# EAGLE design Meshtastic-DIY_v1.03 (EAGLE 9.6.2)
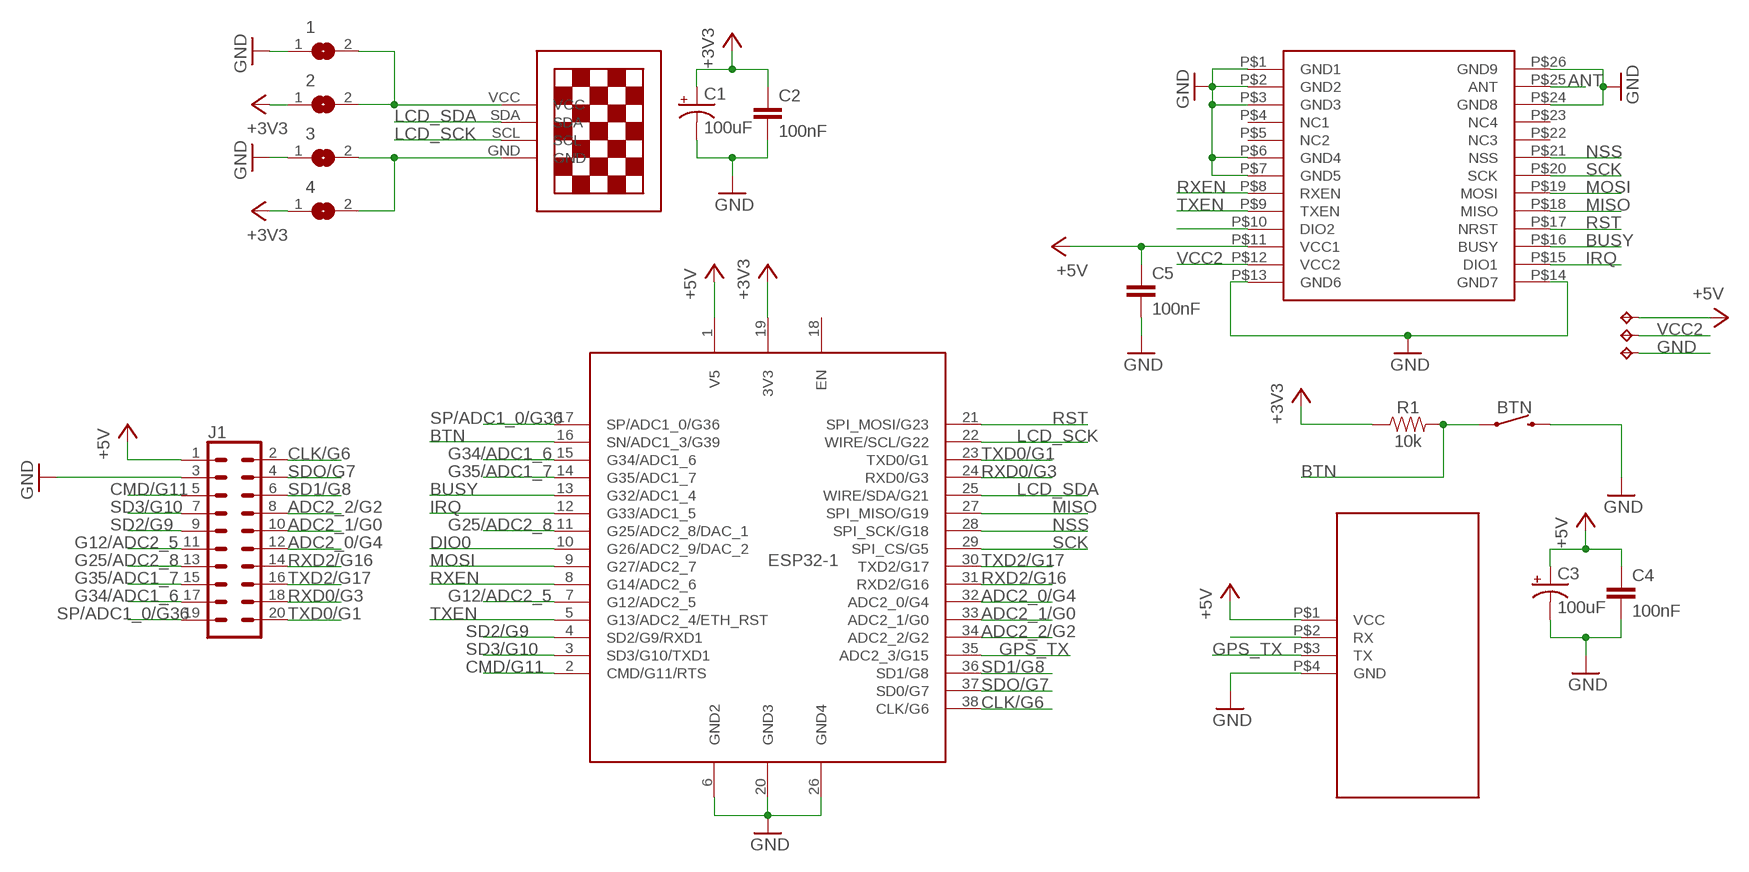
[diagram p0: schematic, sheet 1]

## Parts
1  SJ  [SJ]
2  SJ  [SJ]
3  SJ  [SJ]
4  SJ  [SJ]
BTN  MOMENTARY-SWITCH-SPST-SMD-5.2MM  [TACTILE_SWITCH_SMD_5.2MM]
C1  100uF  100UF-POLAR-EIA7343-10V-10%(TANT)  [EIA7343]
C2  100nF  0.33UF/330NF-0805-50V-10%  [0805]
C3  100uF  100UF-POLAR-EIA7343-10V-10%(TANT)  [EIA7343]
C4  100nF  0.33UF/330NF-0805-50V-10%  [0805]
C5  100nF  0.33UF/330NF-0805-50V-10%  [0805]
ESP32-1  NODEMCU_ESP32_WROOM_32  [NODEMCU_ESP32_WROOM_32--38PINS]
J1  CONN_10X2NOSILK  [2X10_NOSILK]
R1  10k  0.1OHM-1210-1/2W-1%  [1210]
TP1  TPTP14SQ  [TP14SQ]
TP2  TPTP14SQ  [TP14SQ]
TP3  TPTP14SQ  [TP14SQ]
U$1  13"OLED13"OLED  [1.3"OLED]
U$2  E22-XXXMXXS  [E22-XXXMXXS]
U$3  GPS-NEO  [GPS-NEO]

## Nets
+3V3: 2.1 4.1 C1.A(+) C2.1 ESP32-1.19(3V3) R1.1
+5V: C3.A(+) C4.1 C5.1 ESP32-1.1(V5) J1.1 TP1.TP U$2.P$11(VCC1) U$3.P$1(VCC)
ADC2_0/G4: ESP32-1.32(ADC2_0/G4) J1.12
ADC2_1/G0: ESP32-1.33(ADC2_1/G0) J1.10
ADC2_2/G2: ESP32-1.34(ADC2_2/G2) J1.8
ANT: U$2.P$25(ANT)
BTN: BTN.1 ESP32-1.16(SN/ADC1_3/G39) R1.2
BUSY: ESP32-1.13(G32/ADC1_4) U$2.P$16(BUSY)
CLK/G6: ESP32-1.38(CLK/G6) J1.2
CMD/G11: ESP32-1.2(CMD/G11/RTS) J1.5
DIO0: ESP32-1.10(G26/ADC2_9/DAC_2)
G12/ADC2_5: ESP32-1.7(G12/ADC2_5) J1.11
G25/ADC2_8: ESP32-1.11(G25/ADC2_8/DAC_1) J1.13
G34/ADC1_6: ESP32-1.15(G34/ADC1_6) J1.17
G35/ADC1_7: ESP32-1.14(G35/ADC1_7) J1.15
GND: 1.1 3.1 BTN.3 C1.C(-) C2.2 C3.C(-) C4.2 C5.2 ESP32-1.6(GND2) ESP32-1.20(GND3) ESP32-1.26(GND4) J1.3 TP3.TP U$2.P$1(GND1) U$2.P$2(GND2) U$2.P$3(GND3) U$2.P$6(GND4) U$2.P$7(GND5) U$2.P$13(GND6) U$2.P$14(GND7) U$2.P$24(GND8) U$2.P$26(GND9) U$3.P$4(GND)
GPS_TX: ESP32-1.35(ADC2_3/G15) U$3.P$3(TX)
IRQ: ESP32-1.12(G33/ADC1_5) U$2.P$15(DIO1)
LCD_SCK: ESP32-1.22(WIRE/SCL/G22) U$1.SCL
LCD_SDA: ESP32-1.25(WIRE/SDA/G21) U$1.SDA
MISO: ESP32-1.27(SPI_MISO/G19) U$2.P$18(MISO)
MOSI: ESP32-1.9(G27/ADC2_7) U$2.P$19(MOSI)
N$1: U$2.P$10(DIO2)
N$2: 3.2 4.2 U$1.GND
N$3: U$3.P$2(RX)
N$4: 1.2 2.2 U$1.VCC
NSS: ESP32-1.28(SPI_SCK/G18) U$2.P$21(NSS)
RST: ESP32-1.21(SPI_MOSI/G23) U$2.P$17(NRST)
RXD0/G3: ESP32-1.24(RXD0/G3) J1.18
RXD2/G16: ESP32-1.31(RXD2/G16) J1.14
RXEN: ESP32-1.8(G14/ADC2_6) U$2.P$8(RXEN)
SCK: ESP32-1.29(SPI_CS/G5) U$2.P$20(SCK)
SD1/G8: ESP32-1.36(SD1/G8) J1.6
SD2/G9: ESP32-1.4(SD2/G9/RXD1) J1.9
SD3/G10: ESP32-1.3(SD3/G10/TXD1) J1.7
SDO/G7: ESP32-1.37(SD0/G7) J1.4
SP/ADC1_0/G36: ESP32-1.17(SP/ADC1_0/G36) J1.19
TXD0/G1: ESP32-1.23(TXD0/G1) J1.20
TXD2/G17: ESP32-1.30(TXD2/G17) J1.16
TXEN: ESP32-1.5(G13/ADC2_4/ETH_RST) U$2.P$9(TXEN)
VCC2: TP2.TP U$2.P$12(VCC2)
Unconnected: ESP32-1.18(EN) U$2.P$4(NC1) U$2.P$5(NC2) U$2.P$22(NC3) U$2.P$23(NC4)

## Library data of the parts
1-4 = jumper:SJ: SMD solder JUMPER
BTN = SparkFun-Switches:MOMENTARY-SWITCH-SPST: Momentary Switch (Pushbutton) - SPST Normally-open (NO) SPST momentary switches (buttons, pushbuttons). Variants PTH-12MM - 12mm square, through-hole Momentary Pushbutton Switch - 12mm Square <https://www.sparkfun.com/products/9190> (COM-09190) PTH-6.0MM, PTH-6.0MM-KIT - 6.0mm square, through-hole Mini Pushbutton Switch <https://www.sparkfun.com/products/97> (COM-00097) KIT package intended for soldering kit's - only one side of pads' copper is exposed. PTH-RIGHT-ANGLE-KIT - Right-angle, through-hole Right Angle Tactile Button <https://www.sparkfun.com/products/10791> - Used on SparkFun BigTime Watch Kit <https://www.sparkfun.com/products/11734> SMD-12MM - 12mm square, surface-mount Tactile Button - SMD (12mm) <https://www.sparkfun.com/products/12993> (COM-12993) Used on SparkFun PicoBoard <https://www.sparkfun.com/products/11888> SMD-4.5MM - 4.5mm Square Trackball Switch Used on SparkFun Blackberry Trackballer Breakout <https://www.sparkfun.com/products/13169> SMD-4.6MMX2.8MM - 4.60mm x 2.80mm, surface mount Used on SparkFun SAMD21 Mini Breakout <https://www.sparkfun.com/products/13664> SMD-5.2MM, SMD-5.2-REDUNDANT - 5.2mm square, surface-mount Mini Pushbutton Switch - SMD <https://www.sparkfun.com/products/8720> (COM-08720) Used on Arduino Pro Mini <https://www.sparkfun.com/products/11114> REDUNDANT package connects both switch circuits together SMD-6.0X3.5MM - 6.0 x 3.5mm, surface mount Momentary Reset Switch SMD <https://www.sparkfun.com/products/8229> (COM-08229) SMD-6.2MM-TALL - 6.2mm square, surface mount Tactile Button - SMD (6mm) <https://www.sparkfun.com/products/12992> Used on SparkFun Digital Sandbox <https://www.sparkfun.com/products/12651> SMD-RIGHT-ANGLE - Right-angle, surface mount Used on SparkFun Block for Intel® Edison - Arduino <https://www.sparkfun.com/products/13036>; PROD_ID: SWCH-08247; SF_SKU: COM-08720
C1 C3 = SparkFun-Capacitors:100UF-POLAR: 100µF polarized capacitors A capacitor is a passive two-terminal electrical component used to store electrical energy temporarily in an electric field.; PROD_ID: CAP-07890
C2 C4 C5 = SparkFun-Capacitors:0.33UF/330NF: 0.33µF/330nF ceramic capacitors A capacitor is a passive two-terminal electrical component used to store electrical energy temporarily in an electric field.; PROD_ID: CAP-08469; VALUE: 0.33µF
ESP32-1 = ESP32 NODEMCU WROOM 32:NODEMCU_ESP32_WROOM_32: NODEMCU ESP32 WROOM 32 38 Pins PINOUT: https://cdn.shopify.com/s/files/1/1509/1638/files/ESP_-_32_NodeMCU_Developmentboard_Pinout_Diagram.jpg?4479111012146266271; ESP: ESP32 WROOM 32
J1 = SparkFun-Connectors:CONN_10X2: Multi connection point. Often used as Generic Header-pin footprint for 0.1 inch spaced/style header connections On any of the 0.1 inch spaced packages, you can populate with these: Break Away Headers - Straight <https://www.sparkfun.com/products/116> (PRT-00116) Break Away Male Headers - Right Angle <https://www.sparkfun.com/products/553> (PRT-00553) Female Headers <https://www.sparkfun.com/products/115> (PRT-00115) Break Away Headers - Machine Pin <https://www.sparkfun.com/products/117> (PRT-00117) Break Away Female Headers - Swiss Machine Pin <https://www.sparkfun.com/products/743> (PRT-00743) Special note about the "SPECIAL" package: This was SPECIALLY designed to be used with our Graphic LCD Backpack. Be sure you want to use this! It is not only staggered on each line of header holes, but IT IS ALSO offset of the center point of the top and bottom lines by 5 mil. This causes the headers to lock into place on the "standard" footprint on the LCD screen. The extra squares on the tdocu layer are there simply to reference other pins (if you were to actually populate a longer header than ten long - this is what we do with the backpacks).
R1 = SparkFun-Resistors:0.1OHM: 0.1Ω resistor A resistor is a passive two-terminal electrical component that implements electrical resistance as a circuit element. Resistors act to reduce current flow, and, at the same time, act to lower voltage levels within circuits. - Wikipedia; PROD_ID: RES-12374; VALUE: 0.1
TP1-TP3 = testpad:TP: Test pad
U$1 = 13oled:13"OLED
U$2 = E22-XXXMXXS:E22-XXXMXXS
U$3 = 13oled:GPS-NEO

## Board
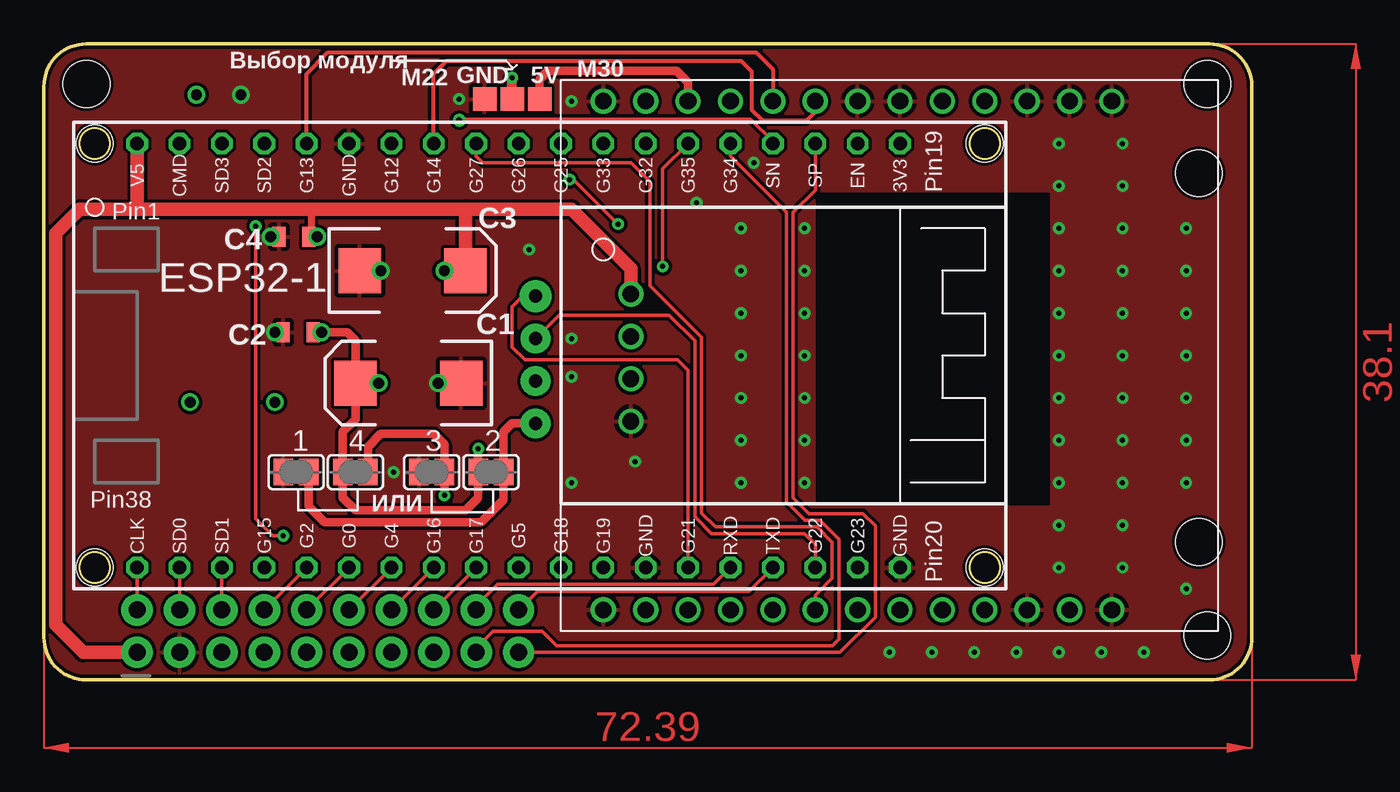
[diagram p1: board, top side]
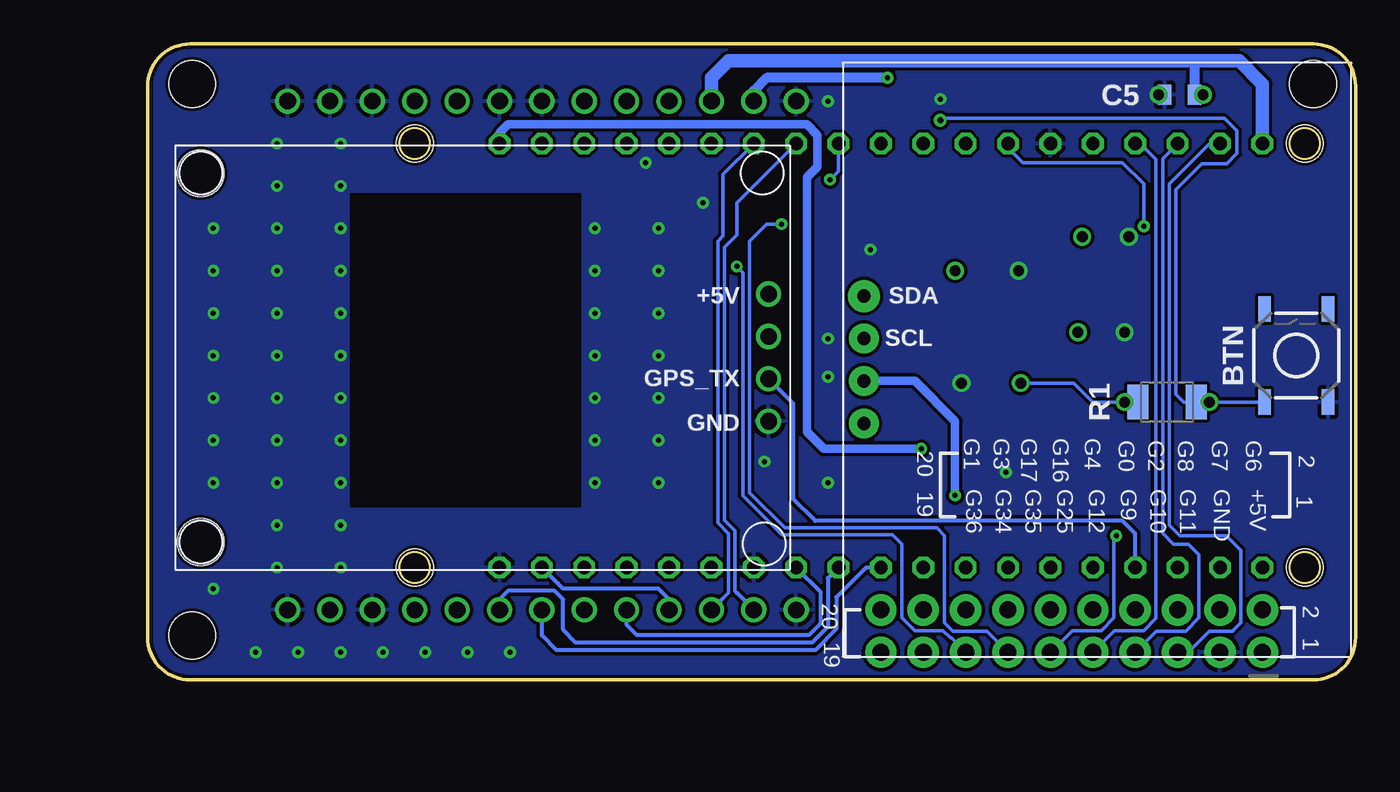
[diagram p2: board, bottom side, seen from below]

Size 72.39 x 38.1 mm. Coordinates in mm from the lower left corner, seen from the top.
Outline: 2.54,0 arc-90 0,2.54 0,35.56 arc-90 2.54,38.1 69.85,38.1 arc-90 72.39,35.56 72.39,2.54 arc-90 69.85,0 2.54,0
Copper layers (1*16): Top 0.035mm / dielectric 1.5mm / Bottom 0.035mm
Design rules "default *": minimum track width 0.2mm, minimum drill 0.25mm, track to track 0.2mm, track to pad 0.2mm, pad to pad 0.2mm, via to via 0.2mm, smd to smd 0.2mm, copper to edge 0.2mm, drill to drill 0.2mm, minimum pad ring 10mil, minimum via ring 8mil, stop-mask expansion 4mil, vias tented up to drill 0.35mm, thermal gap 10mil
Holes 2.2 mm at 3.05,32.13 3.05,6.73 56.39,6.73 56.39,32.13
Holes 2.8 mm at 69.22,8.26 69.22,30.35 2.54,35.69 69.72,35.69 69.72,2.67
tRestrict: 4 lines
bRestrict: 4 lines

### Footprints (pad centres in the part's own frame; a part is rotated, then mirrored left to right if it is on the bottom)
SJ = smd 1.168 x 1.6: 1 -0.762,0; 2 0.762,0
TACTILE_SWITCH_SMD_5.2MM = smd 1.524 x 0.762: 1 -2.794,1.905; 2 2.794,1.905; 3 -2.794,-1.905; 4 2.794,-1.905
EIA7343 = smd 2.55 x 2.7: A 3.17,0; C -3.17,0
0805 = smd 0.8 x 1.2: 1 -0.9,0; 2 0.9,0
NODEMCU_ESP32_WROOM_32--38PINS = drill 0.8 octagon: 1 -13.97,-27.94; 2 -13.97,-25.4; 3 -13.97,-22.86; 4 -13.97,-20.32; 5 -13.97,-17.78; 6 -13.97,-15.24; 7 -13.97,-12.7; 8 -13.97,-10.16; 9 -13.97,-7.62; 10 -13.97,-5.08; 11 -13.97,-2.54; 12 -13.97,0; 13 -13.97,2.54; 14 -13.97,5.08; 15 -13.97,7.62; 16 -13.97,10.16; 17 -13.97,12.7; 18 -13.97,15.24; 19 -13.97,17.78; 20 11.43,17.78; 21 11.43,15.24; 22 11.43,12.7; 23 11.43,10.16; 24 11.43,7.62; 25 11.43,5.08; 26 11.43,2.54; 27 11.43,0; 28 11.43,-2.54; 29 11.43,-5.08; 30 11.43,-7.62; 31 11.43,-10.16; 32 11.43,-12.7; 33 11.43,-15.24; 34 11.43,-17.78; 35 11.43,-20.32; 36 11.43,-22.86; 37 11.43,-25.4; 38 11.43,-27.94
2X10_NOSILK = drill 1.016 pad 1.88: 1 0,0; 2 0,2.54; 3 2.54,0; 4 2.54,2.54; 5 5.08,0; 6 5.08,2.54; 7 7.62,0; 8 7.62,2.54; 9 10.16,0; 10 10.16,2.54; 11 12.7,0; 12 12.7,2.54; 13 15.24,0; 14 15.24,2.54; 15 17.78,0; 16 17.78,2.54; 17 20.32,0; 18 20.32,2.54; 19 22.86,0; 20 22.86,2.54
1210 = smd 1.27 x 2.06: 1 -1.755,0; 2 1.755,0
TP14SQ = smd 1.4 x 1.4: TP 0,0
1.3"OLED = drill 0.8 pad 1.778: GND 2.54,0; SCL 5.08,0; VCC 0,0 | drill 0.8 pad 1.9: SDA 7.62,0
E22-XXXMXXS = drill 1: P$1 -15.24,13.97; P$2 -15.24,11.43; P$3 -15.24,8.89; P$4 -15.24,6.35; P$5 -15.24,3.81; P$6 -15.24,1.27; P$7 -15.24,-1.27; P$8 -15.24,-3.81; P$9 -15.24,-6.35; P$10 -15.24,-8.89; P$11 -15.24,-11.43; P$12 -15.24,-13.97; P$13 -15.24,-16.51; P$14 15.24,-16.51; P$15 15.24,-13.97; P$16 15.24,-11.43; P$17 15.24,-8.89; P$18 15.24,-6.35; P$19 15.24,-3.81; P$20 15.24,-1.27; P$21 15.24,1.27; P$22 15.24,3.81; P$23 15.24,6.35; P$24 15.24,8.89; P$25 15.24,11.43; P$26 15.24,13.97
GPS-NEO = drill 1: P$1 -3.81,16.51; P$2 -1.27,16.51; P$3 1.27,16.51; P$4 3.81,16.51

### Placement (x,y rotation side)
1  15.11,12.45 0 top
2  26.8,12.45 0 top
3  23.24,12.45 0 top
4  18.67,12.45 0 top
BTN  3.56,19.43 90 bottom
C1  21.84,17.78 180 top
C2  15.24,20.83 180 top
C3  22.1,24.51 0 top
C4  14.99,26.54 180 top
C5  10.54,35.05 180 bottom
ESP32-1  33.53,18.16 270 top
J1  5.59,1.65 0 top
R1  11.3,16.64 0 bottom
TP1  29.72,34.8 0 top
TP2  28.07,34.8 0 top
TP3  26.42,34.8 0 top
U$1  29.46,15.37 90 bottom
U$2  50.04,19.43 270 top
U$3  51.69,19.3 270 bottom

### Tracks (layer width: path | path; a pad name or v marks a point on that pad's centre or on a via)
+3V3  (via drill 0.3, 0.65)
  Top 0.406: C2.1 v16.64,20.83
  Top 0.508: v26.04,13.84 2.1 26.04,10.92 25.27,10.16 18.67,10.16 17.91,10.92 4.1 17.91,14.86 18.67,15.63 C1.A | C2.1 18.16,20.83 18.67,20.32 C1.A | v20.07,17.78 C1.A
  Bottom 0.2: R1.1 v13.84,16.64 15.75,16.64 16.89,17.78 v20.07,17.78
  Bottom 0.508: v26.04,13.84 31.88,13.84 32.89,14.86 32.89,30.1 32.26,30.73 32.26,32.64 32.89,33.27 50.8,33.27 51.31,32.77 ESP32-1.19
+5V  (via drill 0.65)
  Top 0.254: C3.A | 25.15,24.51 v24,24.51
  Top 0.406: 16,28.19 16,26.66 C4.1 v16.38,26.54 | C3.A 25.15,24.51
  Top 0.508: TP1.TP 29.72,35.99 30.23,36.5 37.92,36.5 38.61,35.81 U$2.P$11
  Top 0.813: U$3.P$1 35.18,24.64 31.62,28.19 25.27,28.19 | 5.59,28.19 16,28.19 25.27,28.19 | C3.A 25.27,28.19 | J1.1 2.36,1.65 0.71,3.3 0.71,26.74 2.16,28.19 5.59,28.19 | ESP32-1.1 5.59,28.19
  Bottom 0.254: v9.14,35.05 C5.1
  Bottom 0.61: C5.1 9.64,36.97 9.53,37.08
  Bottom 0.813: ESP32-1.1 5.59,35.69 6.98,37.08 9.53,37.08 37.59,37.08 38.61,36.07 U$2.P$11
ADC2_0/G4
  Top 0.2: J1.12 ESP32-1.32
ADC2_1/G0
  Top 0.2: J1.10 ESP32-1.33
ADC2_2/G2
  Top 0.2: J1.8 ESP32-1.34
BTN  (via drill 0.35, 0.65)
  Top 0.2: v24.89,33.53 24.95,33.59 42.36,33.59 43.69,32.26 ESP32-1.16
  Bottom 0.2: v24.89,33.53 24.77,33.66 7.87,33.66 7.11,32.89 7.11,31.54 7.73,30.92 9.21,30.92 10.77,29.36 10.77,17.12 10.29,16.64 R1.2 v8.76,16.64 BTN.1
BUSY
  Bottom 0.2: U$2.P$16 37.59,5.21 37.59,8.76 38.23,9.4 38.23,26.29 37.92,26.6 37.92,30.28 ESP32-1.13
  Bottom 0.254: U$2.P$16 37.92,4.88
CLK/G6
  Top 0.2: J1.2 ESP32-1.38
CMD/G11
  Bottom 0.2: J1.5 10.03,1.65 8.76,2.92 7.37,2.92 7.37,2.95 6.89,3.42 6.89,7.78 7.75,8.64 10.54,8.64 11.17,9.26 11.17,29.73 8.76,32.13 ESP32-1.2
G12/ADC2_5  (via drill 0.3)
  Top 0.2: v14.35,8.64 13.72,8.64 12.7,9.65 v12.7,27.18
  Bottom 0.2: J1.11 16.99,2.95 15.23,2.95 14.48,3.71 14.48,8.51 v14.35,8.64 | v12.7,27.18 12.7,29.72 13.97,30.99 19.94,30.99 20.83,31.88 ESP32-1.7
G25/ADC2_8  (via drill 0.3)
  Top 0.2: v31.5,29.97 31.75,29.97 v34.42,27.3
  Bottom 0.2: J1.13 22.1,2.92 24.13,2.92 24.64,3.43 24.64,8.64 25.1,9.1 34.21,9.1 36.32,11.21 36.32,26.29 35.31,27.3 v34.42,27.3 | ESP32-1.11 30.99,30.48 v31.5,29.97
G34/ADC1_6
  Top 0.2: J1.17 25.91,1.91 26.92,2.92 29.84,2.92 30.71,2.05 47.26,2.05 47.64,2.43 47.64,8.42 46.5,9.56 45.61,9.56 44.51,10.67 44.51,28.01 41.15,31.37 ESP32-1.15
G35/ADC1_7  (via drill 0.3)
  Top 0.2: v37.08,24.77 37.08,30.61 ESP32-1.14
  Bottom 0.2: J1.15 24.24,2.52 24.3,2.52 24.73,2.95 26.42,2.95 27.18,3.71 27.18,8.13 27.75,8.7 34.38,8.7 36.72,11.04 36.72,24.4 v37.08,24.77
GND  (via drill 0.3, 0.65)
  Top 0.406: v13.59,26.54 C4.2 | v13.84,20.83 C2.2 | C3.C v20.19,24.51
  Top 0.508: v23.62,17.78 C1.C
  Bottom 0.254: C5.2 v11.81,35.05
  other vias: 31.62,34.67 24.89,34.8 20.95,12.45 60.83,1.65 63.37,1.65 65.91,1.65 68.45,21.97 60.83,21.97 60.83,24.51 64.64,24.51 68.45,24.51 60.83,27.05 64.64,27.05 68.45,27.05 60.83,11.81 68.45,19.43 64.64,14.35 68.45,5.46 58.29,1.65 55.75,1.65 53.21,1.65 50.67,1.65 60.83,9.27 68.45,16.89 60.83,29.59 60.83,32.13 64.64,32.13 64.64,29.59 42.55,30.99 39.12,28.57 31.62,20.45 29.08,25.78 31.62,18.16 31.62,11.81 35.43,13.08 41.78,27.05 41.78,24.51 41.78,14.35 41.78,11.81 45.59,11.81 45.59,14.35 45.59,24.51 45.59,27.05 68.45,14.35 68.45,11.81 64.64,11.81 64.64,9.27 64.64,6.73 60.83,6.73 41.78,21.97 41.78,19.43 41.78,16.89 45.59,21.97 45.59,19.43 45.59,16.89 60.83,19.43 64.64,21.97 64.64,19.43 64.64,16.89 60.83,16.89 60.83,14.35
  pour Top: -0.38,38.35 -0.38,-0.64 72.9,-0.64 72.9,38.35
  pour Bottom: -0.76,38.61 -0.76,-0.38 73.15,-0.38 73.15,38.61
GPS_TX
  Bottom 0.254: ESP32-1.35 13.21,8.76 13.97,9.53 32.38,9.53 33.71,10.85 33.71,16.56 U$3.P$3
IRQ
  Bottom 0.2: 37.08,5.21 37.19,5.32 37.19,8.93 37.83,9.56 37.83,25.93 37.08,26.67 37.08,28.57 ESP32-1.12
  Bottom 0.254: U$2.P$15 37.08,5.21
LCD_SCK
  Top 0.2: U$1.SCL 30.86,21.84 37.46,21.84 39.01,20.3 39.01,9.76 40.01,8.76 45.59,8.76 46.23,8.13 ESP32-1.22
LCD_SDA
  Top 0.2: U$1.SDA 28.7,22.99 28.07,22.35 28.07,19.94 28.83,19.18 37.97,19.18 38.61,18.54 ESP32-1.25
MISO
  Bottom 0.254: ESP32-1.27 32.08,5.28 32.08,3.37 32.77,2.69 43.07,2.69 43.69,3.3 U$2.P$18
MOSI
  Top 0.2: U$2.P$19 46.23,5.08 47.24,6.1 47.24,8.26 46.34,9.16 40.24,9.16 39.41,9.99 39.41,20.54 36.32,23.62 36.32,29.84 35.18,30.99 26.29,30.99 25.91,31.37 ESP32-1.9
N$2  (via drill 0.3)
  Top 0.508: 4.2 19.43,13.97 20.19,14.73 23.37,14.73 24,14.1 3.2 v24,11.05
  Bottom 0.508: v24,11.05 24,15.49 26.42,17.91 U$1.GND
N$4
  Top 0.508: 1.2 15.88,10.41 16.84,9.45 26.22,9.45 27.56,10.79 2.2 27.56,14.86 28.07,15.37 U$1.VCC
NSS
  Bottom 0.254: ESP32-1.28 31.63,6.09 31.63,3.18 32.57,2.23 46.74,2.23 47.5,2.99 47.5,4.83 48.01,5.33 50.8,5.33 51.31,4.83 U$2.P$21
RST
  Bottom 0.254: U$2.P$17 41.15,4.83 41.78,5.46 47.49,5.46 47.82,5.79 47.83,5.79 ESP32-1.21
RXD0/G3
  Top 0.2: J1.18 25.91,4.45 27.18,5.71 40.13,5.71 ESP32-1.24
RXD2/G16
  Top 0.2: J1.14 ESP32-1.31
RXEN
  Top 0.254: ESP32-1.8 23.37,36.32 24.13,37.08 41.78,37.08 42.42,36.45 42.42,34.16 43.05,33.53 45.72,33.53 46.23,34.04 U$2.P$8
SCK
  Bottom 0.254: ESP32-1.29 29.34,6.73 31.11,4.95 31.11,3.05 32.38,1.78 47.88,1.78 48.77,2.67 U$2.P$20
SD1/G8
  Top 0.2: J1.6 ESP32-1.36
SD2/G9
  Bottom 0.2: J1.9 14.45,2.95 12.69,2.95 11.97,3.68 11.97,31.19 12.91,32.13 ESP32-1.4
SD3/G10
  Bottom 0.2: J1.7 11.94,2.92 10.19,2.92 9.4,3.71 9.4,7.49 10.03,8.13 10.92,8.13 11.57,8.77 11.57,31.23 ESP32-1.3
SDO/G7
  Top 0.2: J1.4 ESP32-1.37
SP/ADC1_0/G36
  Top 0.2: J1.19 47.72,1.65 49.82,3.75 49.82,9.23 49.09,9.96 45.87,9.96 44.91,10.92 44.91,28.02 46.23,29.34 ESP32-1.17
TXD0/G1
  Top 0.2: J1.20 29.57,5.32 42.27,5.32 ESP32-1.23
TXD2/G17
  Top 0.2: J1.16 ESP32-1.30
TXEN
  Top 0.254: ESP32-1.5 15.75,36.32 17.02,37.59 42.67,37.59 43.69,36.58 U$2.P$9
VCC2  (via drill 0.3)
  Top 0.61: TP2.TP v28.07,36.07
  Bottom 0.61: v28.07,36.07 35.31,36.07 36.07,35.31 U$2.P$12
(copper drawn outside any net)
  shapes: Top area x2

### Text on the board
tNames: Выбор модуля | M22 | GND | 5V | M30 | ИЛИ
bNames: SDA | +5V | SCL | GPS_TX | GND | G6 | G7 | G8 | G2 | G0 | G4 | G16 | G17 | G3 | G1 | 20 | 2 | 1 | +5V | GND | G11 | G10 | G9 | G12 | G25 | G35 | G34 | G36 | 19 | 20 | 2 | 1 | 19